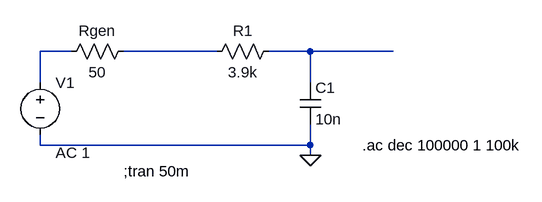
[diagram p0: schematic RC-filter.asc]
RC-filter.asc, the LTspice schematic file:
Version 4
SHEET 1 880 680
WIRE -144 96 -192 96
WIRE 80 96 -64 96
WIRE 224 96 160 96
WIRE 352 96 224 96
WIRE -192 144 -192 96
WIRE 224 144 224 96
WIRE -192 240 -192 224
WIRE 224 240 224 208
WIRE 224 240 -192 240
WIRE 224 256 224 240
FLAG 224 256 0
SYMBOL res 176 80 R90
WINDOW 0 0 56 VBottom 2
WINDOW 3 32 56 VTop 2
SYMATTR InstName R1
SYMATTR Value 3.9k
SYMBOL cap 208 144 R0
SYMATTR InstName C1
SYMATTR Value 10n
SYMBOL voltage -192 128 R0
WINDOW 123 24 124 Left 2
WINDOW 39 0 0 Left 2
SYMATTR Value2 AC 1
SYMATTR InstName V1
SYMATTR Value ""
SYMBOL res -48 80 R90
WINDOW 0 0 56 VBottom 2
WINDOW 3 32 56 VTop 2
SYMATTR InstName Rgen
SYMATTR Value 50
TEXT -64 280 Left 2 !;tran 50m
TEXT 304 240 Left 2 !.ac dec 100000 1 100k

The netlist it stands for:
* RC-filter.asc
R1 N003 N002 3.9k
C1 N003 0 10n
V1 N001 0 AC 1
Rgen N002 N001 50
;tran 50m
.ac dec 100000 1 100k
.backanno
.end